# Altium project tip_driver.PrjPCB
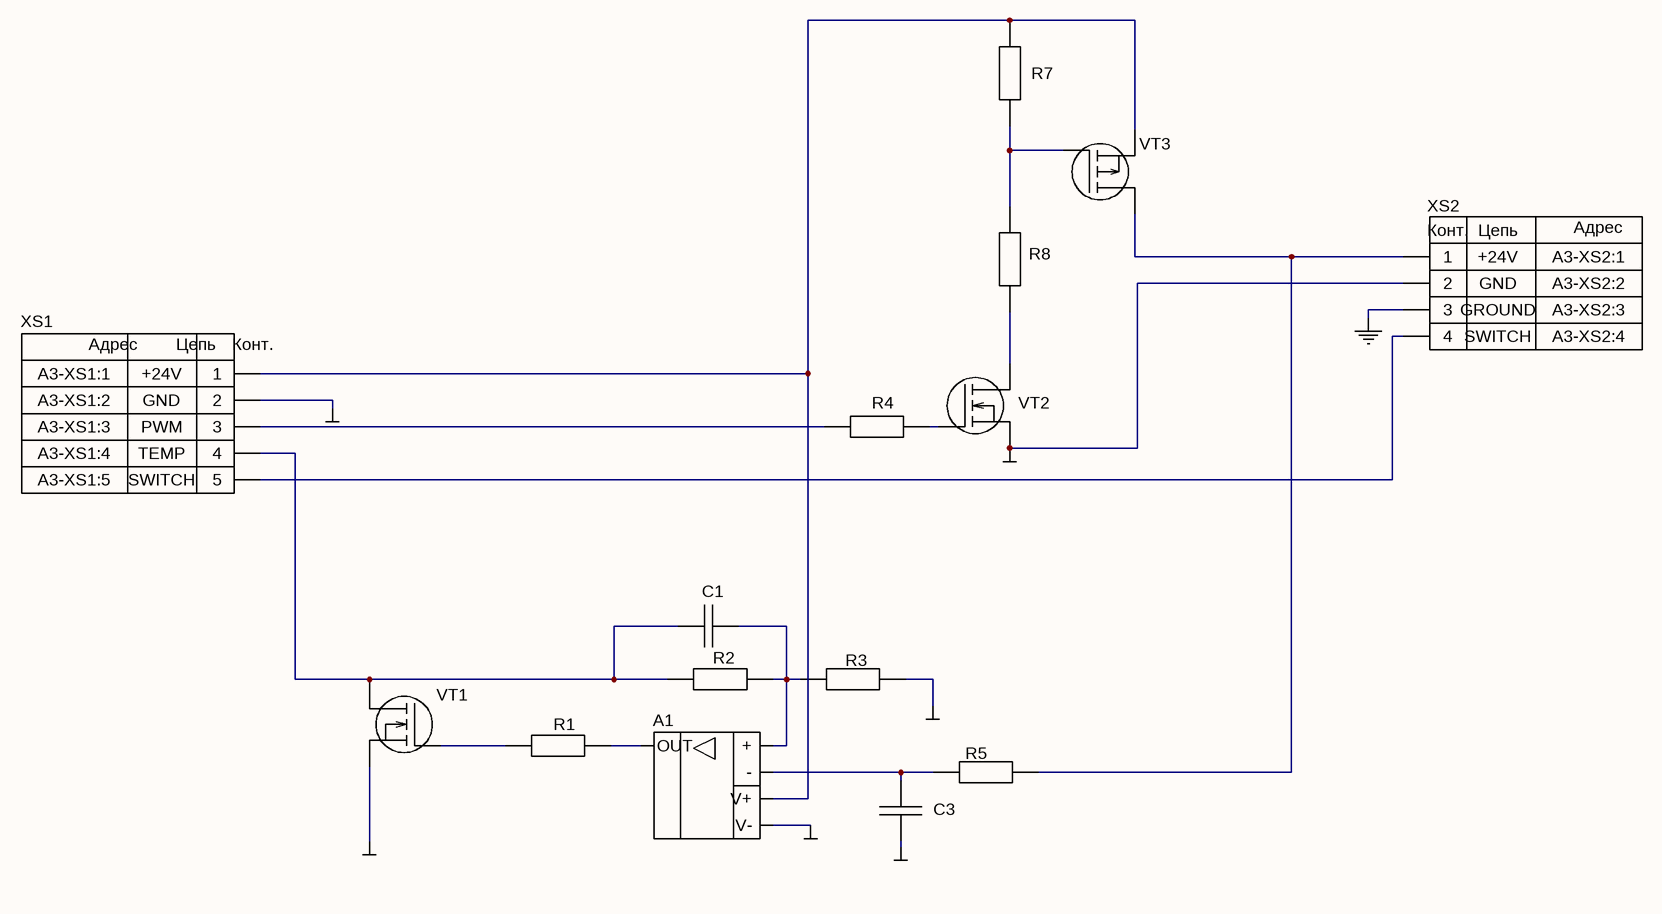
[diagram p0: tip_dirver.SchDoc]
1 sheet, 15 parts. Net scope: global (net labels, ports and power ports of the same name join across sheets).
Board file: tip_driver.PcbDoc

## Sheet tip_dirver.SchDoc
size 420 x 297 mm; PageSetup: Record=PageOptions|CenterHorizontal=True|CenterVertical=True|PrintScale=0.94|XCorrection=1.00|YCorrection=1.00|PrintKind=1|BorderSize=5000000|LeftOffset=0|BottomOffset=0|Orientation=1|PaperLength=1000|PaperWidth=1000|Scale=100|PaperSource=7|PrintQuality=-4|MediaType=1|DitherType=10|PaperKind=A4|PrintScaleMode=1; DecimalNumber: Децимальный номер; HeadOfSector: Нач. сектора; MainDevice: Перв.примен.; Name: Наименование

### Parts
A1  LMV321ILT  [SOT23-5]  (value not drawn)
C1  100 нФ  [CAP: 0603]  (value not drawn)
C3  100 нФ  [CAP: 0603]  (value not drawn)
R1  Res  [RES: 0603]  (value not drawn)
R2  Res  [RES: 0603]  (value not drawn)
R3  Res  [RES: 0603]  (value not drawn)
R4  Res  [RES: 0603]  (value not drawn)
R5  Res  [RES: 0603]  (value not drawn)
R7  Res  [RES: 1206]  (value not drawn)
R8  Res  [RES: 1206]  (value not drawn)
VT1  FDV303N  [SOT23]  (value not drawn)
VT2  FDV303N  [SOT23]  (value not drawn)
VT3  p-mosfet  [DPAK]  (value not drawn)
XS1  cirtuit5: SWITCH  circuit4: TEMP  circuit3: PWM  circuit2: GND  circuit1: +24V  =address5: A3-XS1:5  =address4: A3-XS1:4  =address3: A3-XS1:3  =address2: A3-XS1:2  =address1: A3-XS1:1  [CON: CWF-5]  (hidden comment: X5)
XS2  circuit2: GND  circuit3: GROUND  circuit1: +24V  circuit4: SWITCH  =address4: A3-XS2:4  =address3: A3-XS2:3  =address2: A3-XS2:2  =address1: A3-XS2:1  [HDR1X4]  (hidden comment: X4)

### Nets
GND: A1.2(V-) C3.1 R3.2 VT1.3 VT2.3 XS1.2 XS2.2
GROUND: XS2.3
NetA1_1: A1.1(+) C1.1 R2.2 R3.1
NetA1_3: A1.3(-) C3.2 R5.1
NetA1_4: A1.4(OUT) R1.2
NetA1_5: A1.5(V+) R7.2 VT3.3 XS1.1
NetC1_2: C1.2 R2.1 VT1.2 XS1.4
NetR1_1: R1.1 VT1.1
NetR4_1: R4.1 XS1.3
NetR4_2: R4.2 VT2.1
NetR5_2: R5.2 VT3.2 XS2.1
NetR7_1: R7.1 R8.2 VT3.1
NetR8_1: R8.1 VT2.2
NetXS1_5: XS1.5 XS2.4

### Notes on the sheet
- Перв.примен.
- Справ.№
- Подп. и дата
- Инв.№ дубл.
- Взам.инв.№
- Подп.и дата
- Разраб.
- Изм.
- Лист
- № докум.
- Подп.
- Дата
- Лит.
- Масштаб
- Масса
- Т.контр.
- Пров.
- Листов
- Инв.№ подл.
- Утв.
- Н.контр.
- Нач.сект.
- Формат  A3
- (in symbol X4) Конт.; Цепь; Адрес
- (in symbol X5) Адрес; Цепь; Конт.

### Library data of the parts
A1 = single_channel_op_amp: pin to pad: 1>3 3>4 4>1
C1 C3 = C_const
VT1 VT2 = n-mosfet: pin to pad: 2>3 3>2